# EAGLE schematic funpam-eagle (EAGLE 7.3.0)
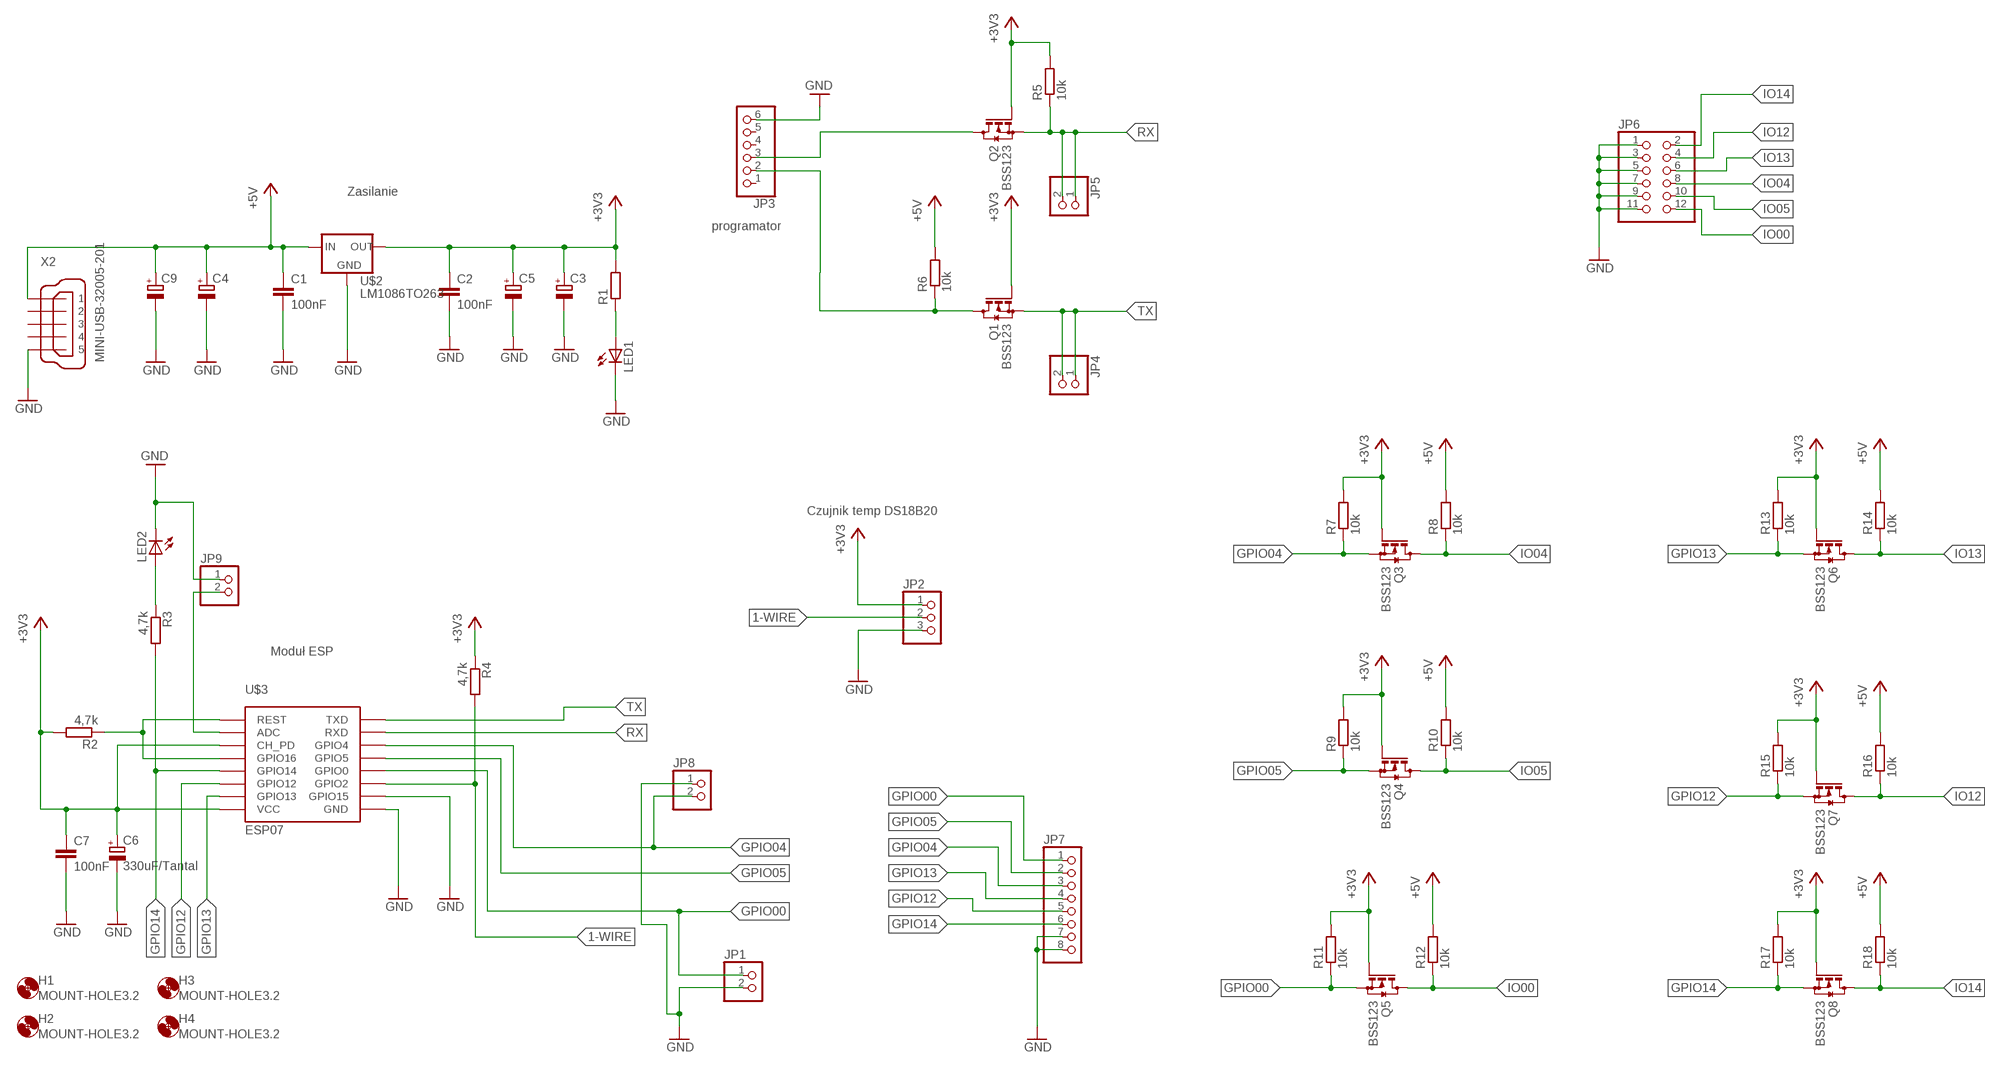
[diagram p0: schematic, sheet 1]

## Parts
C1  100nF  C-EUC1206  [C1206]
C2  100nF  C-EUC1206  [C1206]
C3  CPOL-EU153CLV-0605  [153CLV-0605]
C4  CPOL-EU153CLV-1010  [153CLV-1010]
C5  CPOL-EU153CLV-1010  [153CLV-1010]
C6  330uF/Tantal  CPOL-EUSMCD  [SMC_D]
C7  100nF  C-EUC1206  [C1206]
C9  CPOL-EU153CLV-1010  [153CLV-1010]
H1  MOUNT-HOLE3.2  [3,2]
H2  MOUNT-HOLE3.2  [3,2]
H3  MOUNT-HOLE3.2  [3,2]
H4  MOUNT-HOLE3.2  [3,2]
JP1  PINHD-1X2  [1X02]
JP2  PINHD-1X3  [1X03]
JP3  PINHD-1X6  [1X06]
JP4  PINHD-1X2  [1X02]
JP5  PINHD-1X2  [1X02]
JP6  PINHD-2X6  [2X06]
JP7  PINHD-1X8  [1X08]
JP8  PINHD-1X2  [1X02]
JP9  PINHD-1X2  [1X02]
LED1  LED3MM  [LED3MM]
LED2  LEDCHIPLED_1206  [CHIPLED_1206]
Q1  BSS123  [SOT23]
Q2  BSS123  [SOT23]
Q3  BSS123  [SOT23]
Q4  BSS123  [SOT23]
Q5  BSS123  [SOT23]
Q6  BSS123  [SOT23]
Q7  BSS123  [SOT23]
Q8  BSS123  [SOT23]
R1  R-EU_R1206  [R1206]
R2  4,7k  R-EU_R1206  [R1206]
R3  4,7k  R-EU_R1206  [R1206]
R4  4,7k  R-EU_R1206  [R1206]
R5  10k  R-EU_R1206  [R1206]
R6  10k  R-EU_R1206  [R1206]
R7  10k  R-EU_R1206  [R1206]
R8  10k  R-EU_R1206  [R1206]
R9  10k  R-EU_R1206  [R1206]
R10  10k  R-EU_R1206  [R1206]
R11  10k  R-EU_R1206  [R1206]
R12  10k  R-EU_R1206  [R1206]
R13  10k  R-EU_R1206  [R1206]
R14  10k  R-EU_R1206  [R1206]
R15  10k  R-EU_R1206  [R1206]
R16  10k  R-EU_R1206  [R1206]
R17  10k  R-EU_R1206  [R1206]
R18  10k  R-EU_R1206  [R1206]
U$2  LM1086TO263  [TO263]
U$3  ESP07  [ESP07]
X2  MINI-USB-32005-201  [32005-201]

## Nets
1-WIRE: JP2.2 R4.2 U$3.GPIO2
+3V3: C2.1 C3.+ C5.+ C6.+ C7.1 JP2.1 Q1.1(G) Q2.1(G) Q3.1(G) Q4.1(G) Q5.1(G) Q6.1(G) Q7.1(G) Q8.1(G) R1.2 R2.2 R4.1 R5.2 R7.2 R9.2 R11.2 R13.2 R15.2 R17.2 U$2.2(OUT) U$3.CH_PD U$3.VCC
+5V: C1.1 C4.+ C9.+ R6.2 R8.2 R10.2 R12.2 R14.2 R16.2 R18.2 U$2.3(IN) X2.1
GND: C1.2 C2.2 C3.- C4.- C5.- C6.- C7.2 C9.- JP1.2 JP2.3 JP3.6 JP6.1 JP6.3 JP6.5 JP6.7 JP6.9 JP6.11 JP7.7 JP7.8 JP8.1 JP9.1 LED1.K(C) LED2.C U$2.1(GND) U$3.GND U$3.GPIO15 X2.5
GPIO00: JP1.1 JP7.1 Q5.2(S) R11.1 U$3.GPIO0
GPIO04: JP7.3 JP8.2 Q3.2(S) R7.1 U$3.GPIO4
GPIO05: JP7.2 Q4.2(S) R9.1 U$3.GPIO5
GPIO12: JP7.5 Q7.2(S) R15.1 U$3.GPIO12
GPIO13: JP7.4 Q6.2(S) R13.1 U$3.GPIO13
GPIO14: JP7.6 Q8.2(S) R3.2 R17.1 U$3.GPIO14
IO00: JP6.12 Q5.3(D) R12.1
IO04: JP6.8 Q3.3(D) R8.1
IO05: JP6.10 Q4.3(D) R10.1
IO12: JP6.4 Q7.3(D) R16.1
IO13: JP6.6 Q6.3(D) R14.1
IO14: JP6.2 Q8.3(D) R18.1
N$1: JP3.3 Q2.3(D)
N$2: LED2.A R3.1
N$3: JP9.2 U$3.ADC
N$4: LED1.A R1.1
N$5: JP3.2 Q1.3(D) R6.1
N$7: R2.1 U$3.GPIO16 U$3.REST
RX: JP5.1 JP5.2 Q2.2(S) R5.1 U$3.RXD
TX: JP4.1 JP4.2 Q1.2(S) U$3.TXD
Unconnected: JP3.1 JP3.4 JP3.5 X2.2 X2.3 X2.4

## Notes on the sheet
- Zasilanie
- programator
- Czujnik temp DS18B20
- Moduł ESP

## Library data of the parts
C1 C2 C7 = rcl:C-EU: CAPACITOR, European symbol
C3-C6 C9 = rcl:CPOL-EU: POLARIZED CAPACITOR, European symbol
H1-H4 = holes:MOUNT-HOLE: MOUNTING HOLE with drill center marker
JP1 JP4 JP5 JP8 JP9 = pinhead:PINHD-1X2: PIN HEADER
JP2 = pinhead:PINHD-1X3: PIN HEADER
JP3 = pinhead:PINHD-1X6: PIN HEADER
JP6 = pinhead:PINHD-2X6: PIN HEADER
JP7 = pinhead:PINHD-1X8: PIN HEADER
LED1 LED2 = led:LED: LED OSRAM: - CHIPLED LG R971, LG N971, LY N971, LG Q971, LY Q971, LO R971, LY R971 LH N974, LH R974 LS Q976, LO Q976, LY Q976 LO Q996 - Hyper CHIPLED LW Q18S LB Q993, LB Q99A, LB R99A - SideLED LS A670, LO A670, LY A670, LG A670, LP A670 LB A673, LV A673, LT A673, LW A673 LH A674 LY A675 LS A676, LA A676, LO A676, LY A676, LW A676 LS A679, LY A679, LG A679 - Hyper Micro SIDELED® LS Y876, LA Y876, LO Y876, LY Y876 LT Y87S - SmartLED LW L88C, LW L88S LB L89C, LB L89S, LG L890 LS L89K, LO L89K, LY L89K LS L896, LA L896, LO L896, LY L896 - TOPLED LS T670, LO T670, LY T670, LG T670, LP T670 LSG T670, LSP T670, LSY T670, LOP T670, LYG T670 LG T671, LOG T671, LSG T671 LB T673, LV T673, LT T673, LW T673 LH T674 LS T676, LA T676, LO T676, LY T676, LB T676, LH T676, LSB T676, LW T676 LB T67C, LV T67C, LT T67C, LS T67K, LO T67K, LY T67K, LW E67C LS E67B, LA E67B, LO E67B, LY E67B, LB E67C, LV E67C, LT E67C LW T67C LS T679, LY T679, LG T679 LS T770, LO T770, LY T770, LG T770, LP T770 LB T773, LV T773, LT T773, LW T773 LH T774 LS E675, LA E675, LY E675, LS T675 LS T776, LA T776, LO T776, LY T776, LB T776 LHGB T686 LT T68C, LB T68C - Hyper Mini TOPLED® LB M676 - Mini TOPLED Santana® LG M470 LS M47K, LO M47K, LY M47K Source: http://www.osram.convergy.de LUXEON: - LUMILED® LXK2-PW12-R00, LXK2-PW12-S00, LXK2-PW14-U00, LXK2-PW14-V00 LXK2-PM12-R00, LXK2-PM12-S00, LXK2-PM14-U00 LXK2-PE12-Q00, LXK2-PE12-R00, LXK2-PE12-S00, LXK2-PE14-T00, LXK2-PE14-U00 LXK2-PB12-K00, LXK2-PB12-L00, LXK2-PB12-M00, LXK2-PB14-N00, LXK2-PB14-P00, LXK2-PB14-Q00 LXK2-PR12-L00, LXK2-PR12-M00, LXK2-PR14-Q00, LXK2-PR14-R00 LXK2-PD12-Q00, LXK2-PD12-R00, LXK2-PD12-S00 LXK2-PH12-R00, LXK2-PH12-S00 LXK2-PL12-P00, LXK2-PL12-Q00, LXK2-PL12-R00 Source: www.luxeon.com KINGBRIGHT: KA-3528ASYC Source: www.kingbright.com
Q1-Q8 = transistor-small-signal:BSS123: N-CHANNEL MOS FET
R1-R18 = rcl:R-EU_: RESISTOR, European symbol
U$2 = v-reg-2:LM1086
U$3 = ESP8266-07-12-RE:ESP07: ESP8266 Wifi module 07 RE
X2 = con-cypressindustries:MINI-USB-: MINI USB-B Conector Source: www.cypressindustries.com; OC_FARNELL: unknown; OC_NEWARK: unknown